# Altium schematic sheet Output.SchDoc
size A3; SheetNumber: 3; SheetTotal: 4
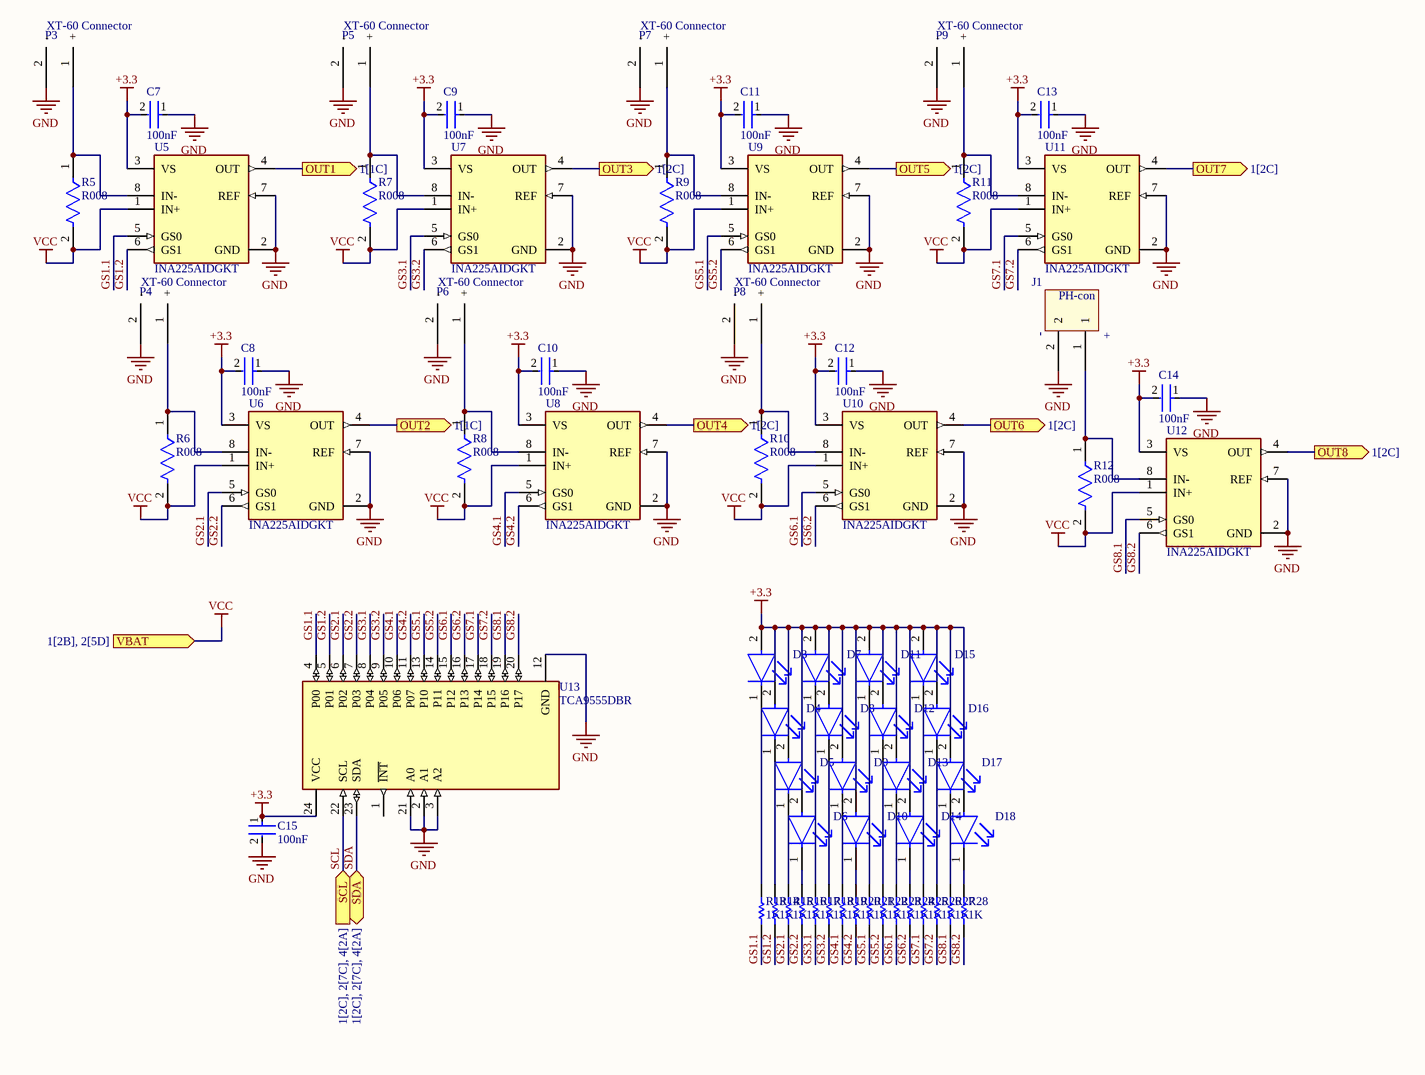
[diagram p0: Output.SchDoc]

## Parts
C7  100nF  [FP-0805-L_2_01_0_2-W_1_25-IPC_B]
C8  100nF  [FP-0805-L_2_01_0_2-W_1_25-IPC_B]
C9  100nF  [FP-0805-L_2_01_0_2-W_1_25-IPC_B]
C10  100nF  [FP-0805-L_2_01_0_2-W_1_25-IPC_B]
C11  100nF  [FP-0805-L_2_01_0_2-W_1_25-IPC_B]
C12  100nF  [FP-0805-L_2_01_0_2-W_1_25-IPC_B]
C13  100nF  [FP-0805-L_2_01_0_2-W_1_25-IPC_B]
C14  100nF  [FP-0805-L_2_01_0_2-W_1_25-IPC_B]
C15  100nF  [FP-0805-L_2_01_0_2-W_1_25-IPC_B]
D3  TLLG4401  [FP-6_544-5255_01-4-MFG]  (value not drawn)
D4  TLLG4401  [FP-6_544-5255_01-4-MFG]  (value not drawn)
D5  TLLG4401  [FP-6_544-5255_01-4-MFG]  (value not drawn)
D6  TLLG4401  [FP-6_544-5255_01-4-MFG]  (value not drawn)
D7  TLLG4401  [FP-6_544-5255_01-4-MFG]  (value not drawn)
D8  TLLG4401  [FP-6_544-5255_01-4-MFG]  (value not drawn)
D9  TLLG4401  [FP-6_544-5255_01-4-MFG]  (value not drawn)
D10  TLLG4401  [FP-6_544-5255_01-4-MFG]  (value not drawn)
D11  TLLG4401  [FP-6_544-5255_01-4-MFG]  (value not drawn)
D12  TLLG4401  [FP-6_544-5255_01-4-MFG]  (value not drawn)
D13  TLLG4401  [FP-6_544-5255_01-4-MFG]  (value not drawn)
D14  TLLG4401  [FP-6_544-5255_01-4-MFG]  (value not drawn)
D15  TLLG4401  [FP-6_544-5255_01-4-MFG]  (value not drawn)
D16  TLLG4401  [FP-6_544-5255_01-4-MFG]  (value not drawn)
D17  TLLG4401  [FP-6_544-5255_01-4-MFG]  (value not drawn)
D18  TLLG4401  [FP-6_544-5255_01-4-MFG]  (value not drawn)
J1  PH-con  [Phoenix]
P3  XT-60 Connector  [2]
P4  XT-60 Connector  [2]
P5  XT-60 Connector  [2]
P6  XT-60 Connector  [2]
P7  XT-60 Connector  [2]
P8  XT-60 Connector  [2]
P9  XT-60 Connector  [2]
R5  R008  [FP-RL2512-MFG]
R6  R008  [FP-RL2512-MFG]
R7  R008  [FP-RL2512-MFG]
R8  R008  [FP-RL2512-MFG]
R9  R008  [FP-RL2512-MFG]
R10  R008  [FP-RL2512-MFG]
R11  R008  [FP-RL2512-MFG]
R12  R008  [FP-RL2512-MFG]
R13  1K  [RESC2013X60X35ML10T20]
R14  1K  [RESC2013X60X35ML10T20]
R15  1K  [RESC2013X60X35ML10T20]
R16  1K  [RESC2013X60X35ML10T20]
R17  1K  [RESC2013X60X35ML10T20]
R18  1K  [RESC2013X60X35ML10T20]
R19  1K  [RESC2013X60X35ML10T20]
R20  1K  [RESC2013X60X35ML10T20]
R21  1K  [RESC2013X60X35ML10T20]
R22  1K  [RESC2013X60X35ML10T20]
R23  1K  [RESC2013X60X35ML10T20]
R24  1K  [RESC2013X60X35ML10T20]
R25  1K  [RESC2013X60X35ML10T20]
R26  1K  [RESC2013X60X35ML10T20]
R27  1K  [RESC2013X60X35ML10T20]
R28  1K  [RESC2013X60X35ML10T20]
U5  INA225AIDGKT  [FP-INA225AIDGKT-IPC_A]
U6  INA225AIDGKT  [FP-INA225AIDGKT-IPC_A]
U7  INA225AIDGKT  [FP-INA225AIDGKT-IPC_A]
U8  INA225AIDGKT  [FP-INA225AIDGKT-IPC_A]
U9  INA225AIDGKT  [FP-INA225AIDGKT-IPC_A]
U10  INA225AIDGKT  [FP-INA225AIDGKT-IPC_A]
U11  INA225AIDGKT  [FP-INA225AIDGKT-IPC_A]
U12  INA225AIDGKT  [FP-INA225AIDGKT-IPC_A]
U13  TCA9555DBR  [FP-DB0024A-IPC_A]

## Ports
OUT1 (out, see 1[1C]), OUT2 (out, see 1[1C]), OUT3 (out, see 1[2C]), OUT4 (out, see 1[2C]), OUT5 (out, see 1[2C]), OUT6 (out, see 1[2C]), OUT7 (out, see 1[2C]), OUT8 (out, see 1[2C]), SCL (in, see 1[2C], 2[7C], 4[2A]), SDA (bidir, see 1[2C], 2[7C], 4[2A]), VBAT (in, see 1[2B], 2[5D])

## Nets
+3.3: C7.2 C8.2 C9.2 C10.2 C11.2 C12.2 C13.2 C14.2 C15.1 D3.2(A) D4.2(A) D5.2(A) D6.2(A) D7.2(A) D8.2(A) D9.2(A) D10.2(A) D11.2(A) D12.2(A) D13.2(A) D14.2(A) D15.2(A) D16.2(A) D17.2(A) D18.2(A) U5.3(VS) U6.3(VS) U7.3(VS) U8.3(VS) U9.3(VS) U10.3(VS) U11.3(VS) U12.3(VS) U13.24(VCC)
GND: C7.1 C8.1 C9.1 C10.1 C11.1 C12.1 C13.1 C14.1 C15.2 J1.2 P3.2(-) P4.2(-) P5.2(-) P6.2(-) P7.2(-) P8.2(-) P9.2(-) U5.2(GND) U5.7(REF) U6.2(GND) U6.7(REF) U7.2(GND) U7.7(REF) U8.2(GND) U8.7(REF) U9.2(GND) U9.7(REF) U10.2(GND) U10.7(REF) U11.2(GND) U11.7(REF) U12.2(GND) U12.7(REF) U13.2(A1) U13.3(A2) U13.12(GND) U13.21(A0)
VCC: R5.2 R6.2 R7.2 R8.2 R9.2 R10.2 R11.2 R12.2 U5.1(IN+) U6.1(IN+) U7.1(IN+) U8.1(IN+) U9.1(IN+) U10.1(IN+) U11.1(IN+) U12.1(IN+) ; port VBAT
GS1.1: R13.1 U5.5(GS0) U13.4(P00)
GS1.2: R14.1 U5.6(GS1) U13.5(P01)
GS2.1: R15.1 U6.5(GS0) U13.6(P02)
GS2.2: R16.1 U6.6(GS1) U13.7(P03)
GS3.1: R17.1 U7.5(GS0) U13.8(P04)
GS3.2: R18.1 U7.6(GS1) U13.9(P05)
GS4.1: R19.1 U8.5(GS0) U13.10(P06)
GS4.2: R20.1 U8.6(GS1) U13.11(P07)
GS5.1: R21.1 U9.5(GS0) U13.13(P10)
GS5.2: R22.1 U9.6(GS1) U13.14(P11)
GS6.1: R23.1 U10.5(GS0) U13.15(P12)
GS6.2: R24.1 U10.6(GS1) U13.16(P13)
GS7.1: R25.1 U11.5(GS0) U13.17(P14)
GS7.2: R26.1 U11.6(GS1) U13.18(P15)
GS8.1: R27.1 U12.5(GS0) U13.19(P16)
GS8.2: R28.1 U12.6(GS1) U13.20(P17)
OUT1: U5.4(OUT) ; port OUT1
OUT2: U6.4(OUT) ; port OUT2
OUT3: U7.4(OUT) ; port OUT3
OUT4: U8.4(OUT) ; port OUT4
OUT5: U9.4(OUT) ; port OUT5
OUT6: U10.4(OUT) ; port OUT6
OUT7: U11.4(OUT) ; port OUT7
OUT8: U12.4(OUT) ; port OUT8
SCL: U13.22(SCL) ; port SCL
SDA: U13.23(SDA) ; port SDA
NetD3_1: D3.1(C) R13.2
NetD4_1: D4.1(C) R14.2
NetD5_1: D5.1(C) R15.2
NetD6_1: D6.1(C) R16.2
NetD7_1: D7.1(C) R17.2
NetD8_1: D8.1(C) R18.2
NetD9_1: D9.1(C) R19.2
NetD10_1: D10.1(C) R20.2
NetD11_1: D11.1(C) R21.2
NetD12_1: D12.1(C) R22.2
NetD13_1: D13.1(C) R23.2
NetD14_1: D14.1(C) R24.2
NetD15_1: D15.1(C) R25.2
NetD16_1: D16.1(C) R26.2
NetD17_1: D17.1(C) R27.2
NetD18_1: D18.1(C) R28.2
NetJ1_1: J1.1 R12.1 U12.8(IN-)
NetP3_1: P3.1(+) R5.1 U5.8(IN-)
NetP4_1: P4.1(+) R6.1 U6.8(IN-)
NetP5_1: P5.1(+) R7.1 U7.8(IN-)
NetP6_1: P6.1(+) R8.1 U8.8(IN-)
NetP7_1: P7.1(+) R9.1 U9.8(IN-)
NetP8_1: P8.1(+) R10.1 U10.8(IN-)
NetP9_1: P9.1(+) R11.1 U11.8(IN-)

Not connected (* = marked no-connect by the designer): U13 1(~{INT})

## Notes on the sheet
- (in symbol Connector_2) -; +

## Library data of the parts
C7-C15 = CMP-2007-04174-2: General Purpose Ceramic Capacitor, 0805, 100nF, 10%, X7R, 15%, 100V; Packaging: Tape and Reel; Min Operating Temperature: -55°C; Dielectric Material: Ceramic; Height: 1.4mm; Voltage Rating: 100V; Termination: SMD/SMT; Case Code (Imperial): 0805; Case Code (Metric): 2012; Case/Package: 0805; Construction: Flat; Radiation Hardening: No; Series: -; Dielectric: X7R; Package Quantity: 2000; Mount: Surface Mount; Capacitance: 100nF; Contact Plating: Tin; Voltage: 100V; Lead Free: Lead Free; Depth: 1.25mm; RoHS Compliant: Yes; Number of Pins: 2; Max Operating Temperature: 125°C; Length: 2.01mm; Voltage Rating (DC): 100V; Thickness: 0.055inch; REACH SVHC: No SVHC; Width: 0.049inch; Tolerance: 10%
D3-D18 = CMP-00030-39390728-1: TLLG4401 LED, Green, 2mcd, 3mmDia., T-1, +/-25deg, 565nm, 7mA, 1.9V Vf, 20V Vr, 20mW, -40; Test Current: 2mA; Wavelength: 575nm; Number of Elements: 1; Viewing Angle: 25°; Lens Transparency: Diffused; Voltage Rating (DC): 2.4V; Lead Length: 23mm; Max Junction Temperature (Tj): 100°C; Lens Style: Circular, Colored, Diffused, Dome, Round, Tinted; Reverse Voltage: 6V; Forward Voltage: 1.9V; Length: 3.2mm; Forward Current: 2mA; Color: Green; Dominant Wavelength: 575nm; Radiation Hardening: No; NexarPartId: 39390728; Lens Color: Green; REACH SVHC: Unknown; Lead Free: Lead Free; Number of Pins: 2; Luminous Intensity: 2mcd; Schedule B: 8541402000, 8541402000; Max Operating Temperature: 100°C; Illumination Color: Green; Mount: Through Hole; Packaging: Bulk; Depth: 3.2mm; Ambient Temperature Range High: 100°C; Case/Package: Radial; Power Dissipation: 20mW; Height: 4.5mm; RoHS: Compliant; Peak Wavelength: 565nm; Min Operating Temperature: -40°C; Number of LEDs: 1
J1 = Connector_2
P3-P9 = XT-60 Connector: Manufacturer: POLOLU; Manufacturer Part Number: XT60 YELLOW; Unit: pcs; SuppliedAmount: 0; MinAmount: 1; Type of robotics accessories: power connector; Maximum current: 65A; Information: Product is not a working device, but only component; Supplier 1: TME; Category: Power Supply Modules; Stock 1: 29; Pricing 1: 1=2.08, 10=1.95 (USD); Weight: 7.267; Multiples: 1; Number of pins: 2; Colour: yellow; Price Type: NET; ComponentLink1URL: http://static.tme.eu/products_pics/8/b/5/8b5040a8a5baf3e0e67386c2e3a9b903/913.jpg; ComponentLink1Description: http://static.tme.eu/products_pics/8/b/5/8b5040a8a5baf3e0e67386c2e3a9b903/913.jpg; Supplier Part Number 1: XT-60 Connector
R5-R12 = CMP-03412-013102-1: RES 0.1 OHM 1% 1W 2512; Manufacturer: YAGEO; Manufacturer Part Number: RL2512FK-070R1L; Automotive Grade: Grade 0; Temperature Coefficient: 600ppm/°C; Value: 100mΩ; Lead Free: Yes; Package: RL2512; Temperature Range High: +155°C; Octopart: https://octopart.com/rl2512fk-070r1l-yageo-42334369; Composition: Thick Film; Height: 0.65mm; ComponentLink2URL: http://www.yageo.com/documents/recent/PYu-RL_Group_521_RoHS_L_2.pdf; Device Class L3: Chip SMD Resistors; Automotive: Yes; Series: RL; Device Class L1: Passive Components; Device Class L2: Resistors; Mouser Description: Current Sense Resistors 0.1ohm 1% 1W; Temperature: -55°C to +155°C; ComponentLink2Description: Datasheet; Footprint Url: http://www.yageo.com/exep/pages/download/literatures/PYu-R_Mount_10.pdf; Ipc Land Pattern Name: RESC635320X55; RoHS: TRUE; Category: Res; Temperature Range Low: -55°C; Power Rating: 1W; Tolerance: 1%; Resistance: 100mΩ; Digikey Description: RES 0.1 OHM 1% 1W 2512
R13-R28 = CMP-2100-03671-1: Chip Resistor, 1 KOhm, +/- 1%, 125 mW, -55 to 155 degC, 0805 (2012 Metric), RoHS, Tape and Reel; Manufacturer: Yageo; Temperature Coefficient: 100ppm/degreesC; Voltage Rating (DC): 150V; Max Power Dissipation: 125mW; Resistance: 1KOhm; Number of Pins: 2; Number of Terminations: 2; Datasheet URL: http://www.yageo.com/NewPortal/yageodocoutput?fileName=/pdf/R-Chip/PYu-RC_Group_51_RoHS_L_5.pdf; Length: 0.079inch; Package Description: 2-Pin Surface Mounted Device, Body 2 x 1.25 mm; Depth: 1.25mm; Height: 0.024inch; Military Standard: Not; Case/Package: 0805; Package Reference: 0805; RoHSCompliant: true; Lead Free: LeadFree; Packaging: TapeandReel; Package Quantity: 1; Datasheet Version: Rev. 5, 10/2016; Tolerance: 1%; Min Operating Temperature: -55degC; Voltage Rating: 150V; Composition: ThickFilm; Case Code (Imperial): 0805; Power Rating: 125mW; Width: 0.049inch; Case Code (Metric): 2012; Manufacturer URL: http://www.yageo.com/; Max Operating Temperature: 155degC; REACH SVHC: Unknown; Termination: SMD/SMT
U5-U12 = CMP-04895-000038-1: IC MONITOR PWR/CUR BIDIR 8VSSOP; Manufacturer: Texas Instruments; Nominal Supply Current: 300uA; Input Bias Current: 72uA; Bandwidth: 250kHz; Number Of Channels: 1; Voltage Gain: 0.025/0.05/0.1/0.2V/mV; Standoff Height: 0.05mm; Min Supply Voltage: 2.7V; Input Offset Voltage: 0.075mV; Max Junction Temp: +150°C; Max Supply Voltage: 36V; Ipc Land Pattern Name: SOIC65P490X110-8; Device Class L2: Linear ICs; Automotive: No; Ambient Temperature Range Low: -40°C; Octopart: https://octopart.com/ina225aidgkt-texas+instruments-28946314; Ambient Temperature Range High: +125°C; RoHS: TRUE; Height: 1.1mm; Temperature Range High: +125°C; Package: VSSOP8; Temperature Range Low: -40°C; Temperature: -40°C to +125°C; Lead Free: Yes; Digikey Description: IC MONITOR PWR/CUR BIDIR 8VSSOP; Device Class L1: Integrated Circuits (ICs); Mouser Description: Current Sense Amplifiers 36V Bidir 0-Drift Ser Crnt-Shunt Mon; Device Class L3: Instrumentation; Manufacturer Part Number: INA225AIDGKT; Category: IC; ComponentLink2Description: Datasheet; ComponentLink2URL: http://www.ti.com/lit/ds/symlink/ina225.pdf
U13 = CMP-04886-000014-1: IC I/O EXPANDER 16B 24SSOP; Interface: I2C; Max Supply Voltage: 5.5V; Number of I/Os: 16; Min Supply Voltage: 1.65V; RoHS Compliant: Yes; Case/Package: SSOP; Min Operating Temperature: -40°C; Packaging: Cut Tape; Max Operating Temperature: 85°C; Lead Free: Lead Free; Number of Pins: 24